# EAGLE design jerry_v1 (EAGLE 9.5.2)
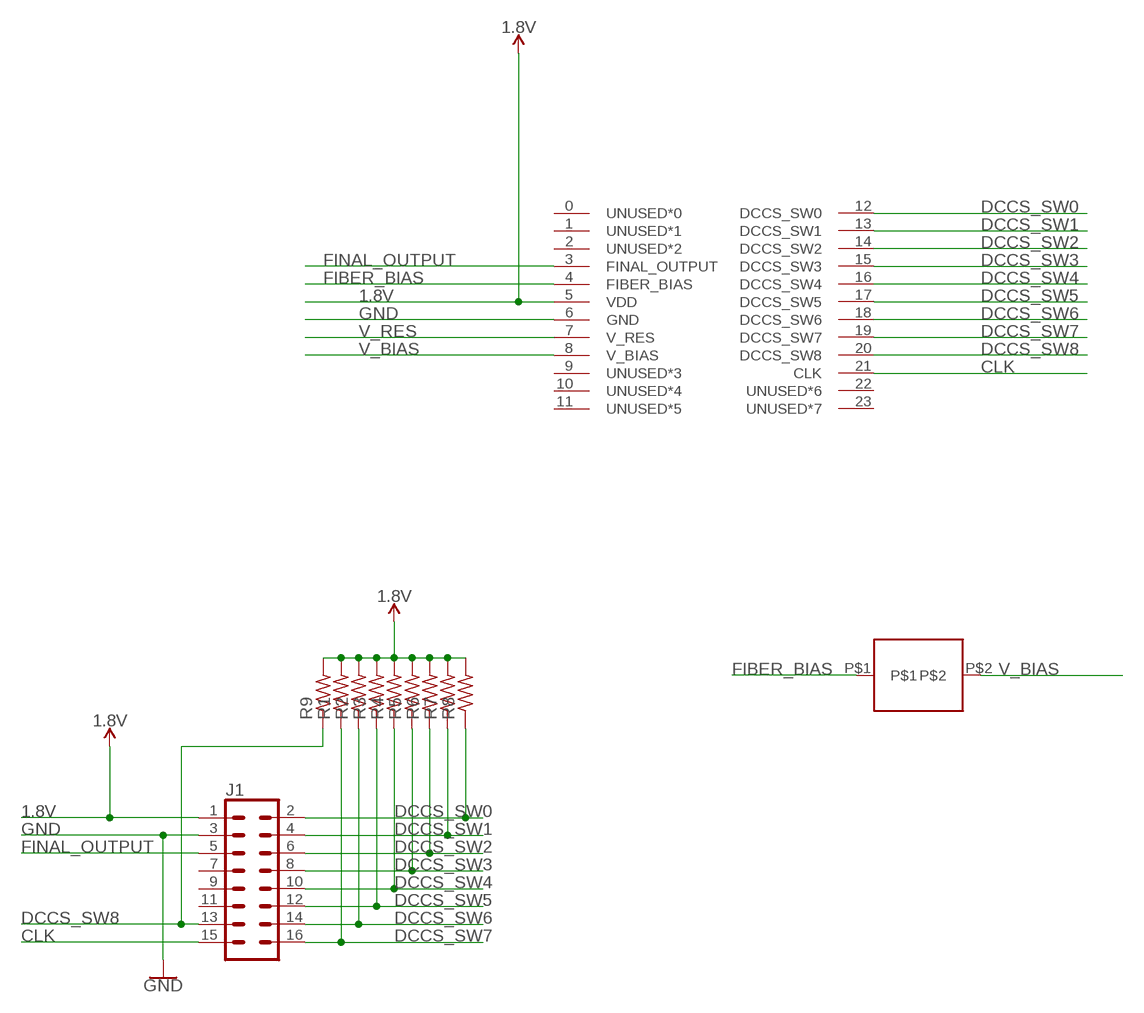
[diagram p0: schematic, sheet 1]

## Parts
J1  CONN_08X2  [2X8]
R1  R-US_R0402  [R0402]
R2  R-US_R0402  [R0402]
R3  R-US_R0402  [R0402]
R4  R-US_R0402  [R0402]
R5  R-US_R0402  [R0402]
R6  R-US_R0402  [R0402]
R7  R-US_R0402  [R0402]
R8  R-US_R0402  [R0402]
R9  R-US_R0402  [R0402]
U$1  JERRY_V1  [JERRY_V1]
U$2  FIBER  [FIBER]

## Nets
1.8V: J1.1 R1.2 R2.2 R3.2 R4.2 R5.2 R6.2 R7.2 R8.2 R9.2 U$1.5(VDD)
CLK: J1.15 U$1.21(CLK)
DCCS_SW0: J1.2 R8.1 U$1.12(DCCS_SW0)
DCCS_SW1: J1.4 R7.1 U$1.13(DCCS_SW1)
DCCS_SW2: J1.6 R6.1 U$1.14(DCCS_SW2)
DCCS_SW3: J1.8 R5.1 U$1.15(DCCS_SW3)
DCCS_SW4: J1.10 R4.1 U$1.16(DCCS_SW4)
DCCS_SW5: J1.12 R3.1 U$1.17(DCCS_SW5)
DCCS_SW6: J1.14 R2.1 U$1.18(DCCS_SW6)
DCCS_SW7: J1.16 R1.1 U$1.19(DCCS_SW7)
DCCS_SW8: J1.13 R9.1 U$1.20(DCCS_SW8)
FIBER_BIAS: U$1.4(FIBER_BIAS) U$2.P$1
FINAL_OUTPUT: J1.5 U$1.3(FINAL_OUTPUT)
GND: J1.3 U$1.6(GND)
V_BIAS: U$1.8(V_BIAS) U$2.P$2
V_RES: U$1.7(V_RES)
Unconnected: J1.7 J1.9 J1.11 U$1.0(UNUSED*0) U$1.1(UNUSED*1) U$1.2(UNUSED*2) U$1.9(UNUSED*3) U$1.10(UNUSED*4) U$1.11(UNUSED*5) U$1.22(UNUSED*6) U$1.23(UNUSED*7)

## Library data of the parts
J1 = SparkFun-Connectors:CONN_08X2: Multi connection point. Often used as Generic Header-pin footprint for 0.1 inch spaced/style header connections You can populate with any combo of single row headers, but if you'd like an exact match, check this: Header - 2x8 (Male, 0.1") <https://www.sparkfun.com/products/13156> (PRT-13156) On any of the 0.1 inch spaced packages, you can populate with these: Break Away Headers - Straight <https://www.sparkfun.com/products/116> (PRT-00116) Break Away Male Headers - Right Angle <https://www.sparkfun.com/products/553> (PRT-00553) Female Headers <https://www.sparkfun.com/products/115> (PRT-00115) Break Away Headers - Machine Pin <https://www.sparkfun.com/products/117> (PRT-00117) Break Away Female Headers - Swiss Machine Pin <https://www.sparkfun.com/products/743> (PRT-00743)
R1-R9 = rcl:R-US_: RESISTOR, American symbol; SPICEPREFIX: R
U$1 = jerry:JERRY_V1
U$2 = jerry:FIBER

## Board
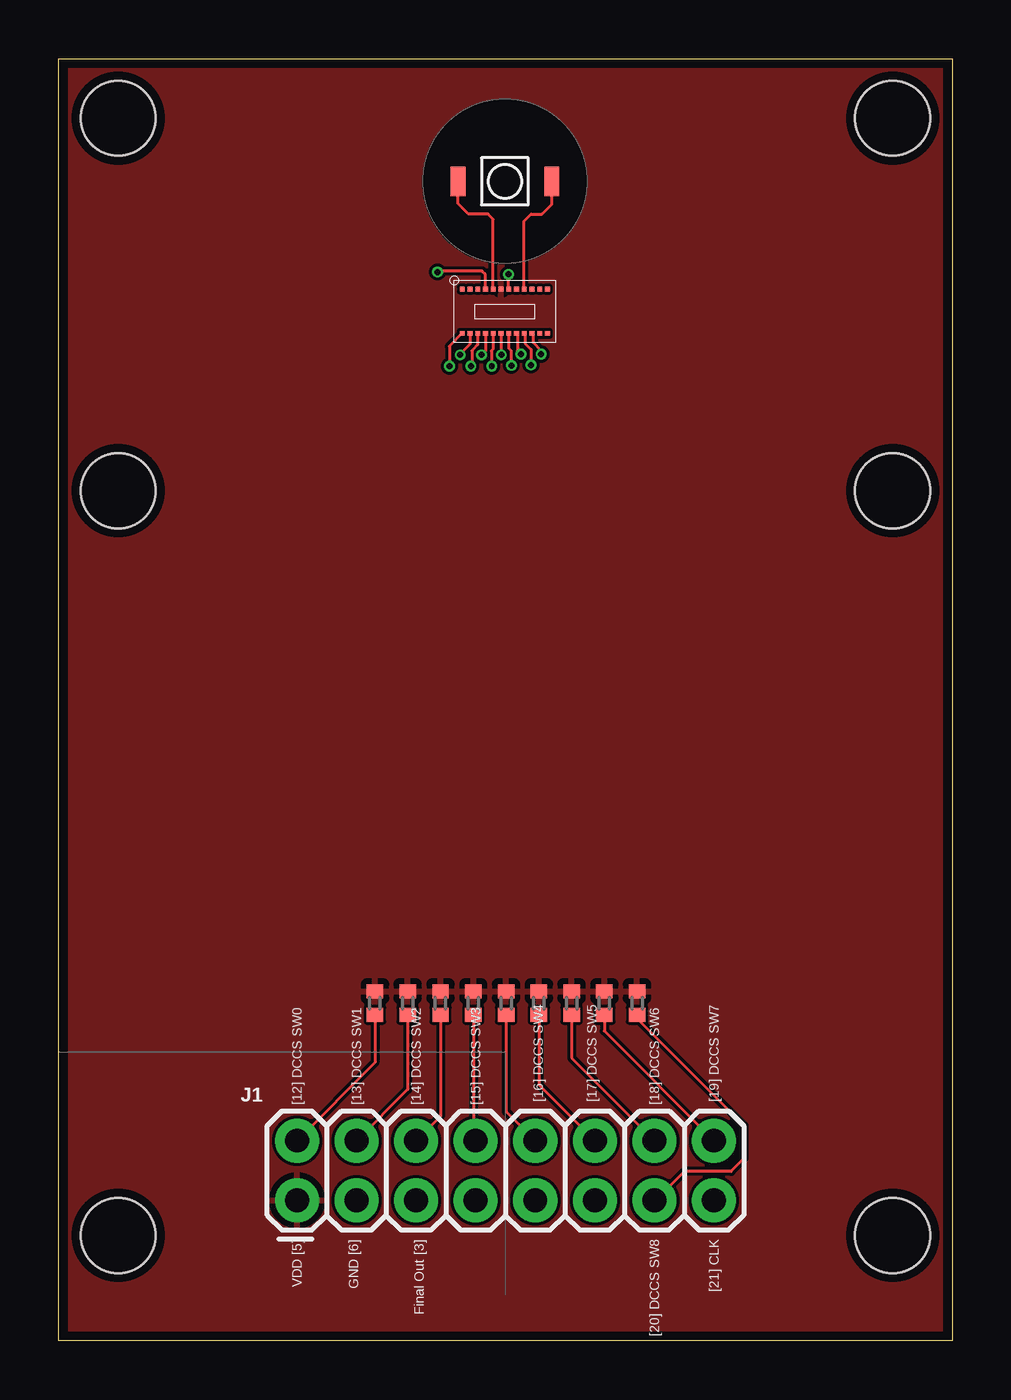
[diagram p1: board, top side]
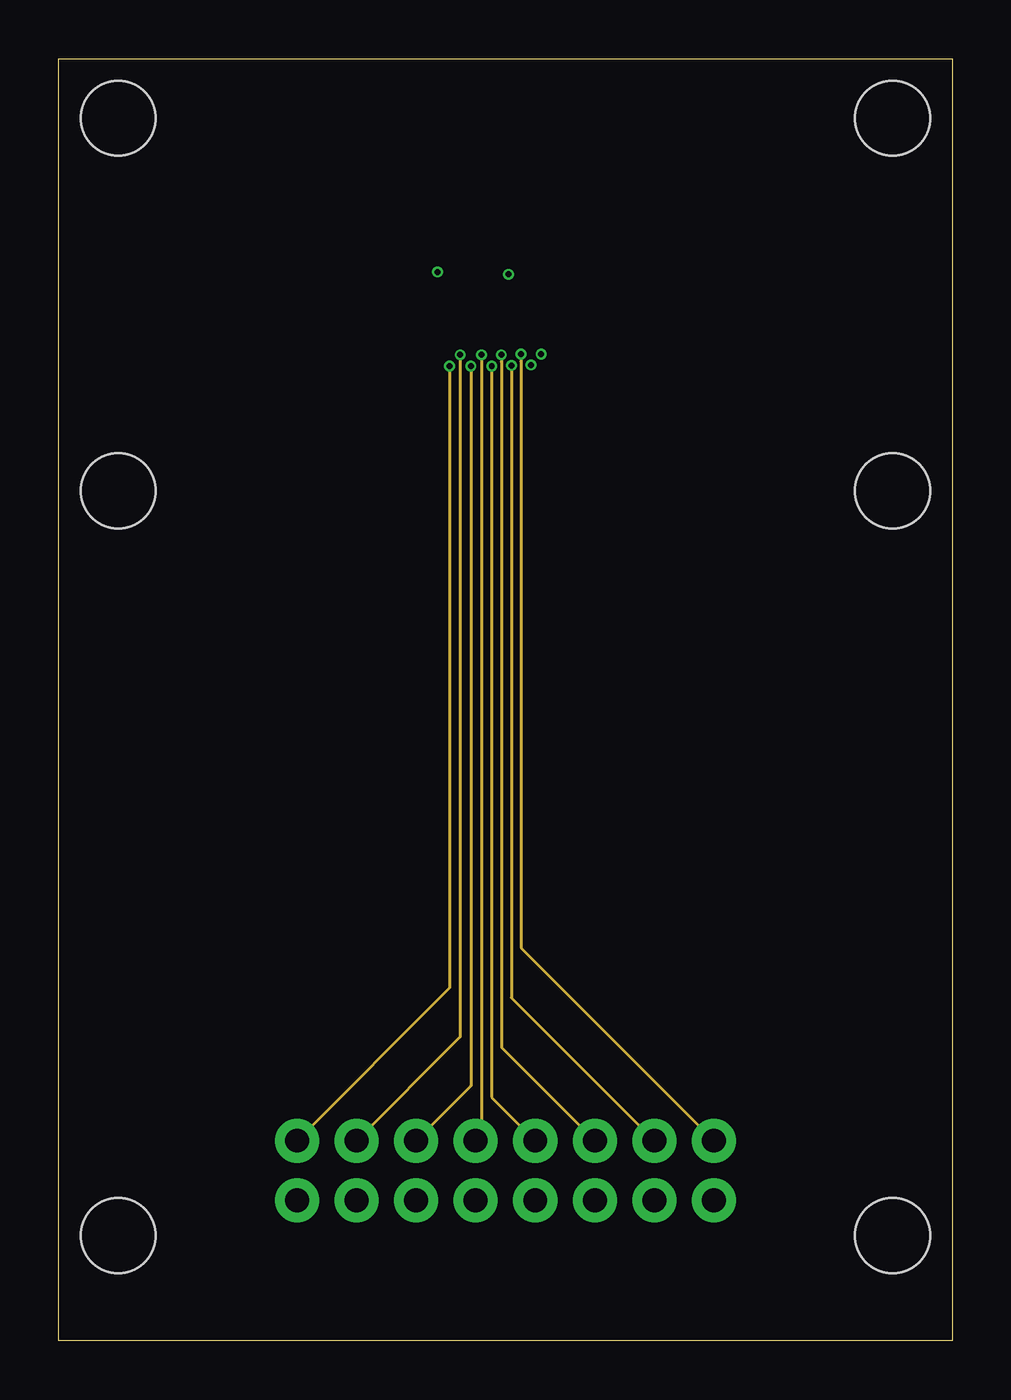
[diagram p2: board, inner layer Route2]
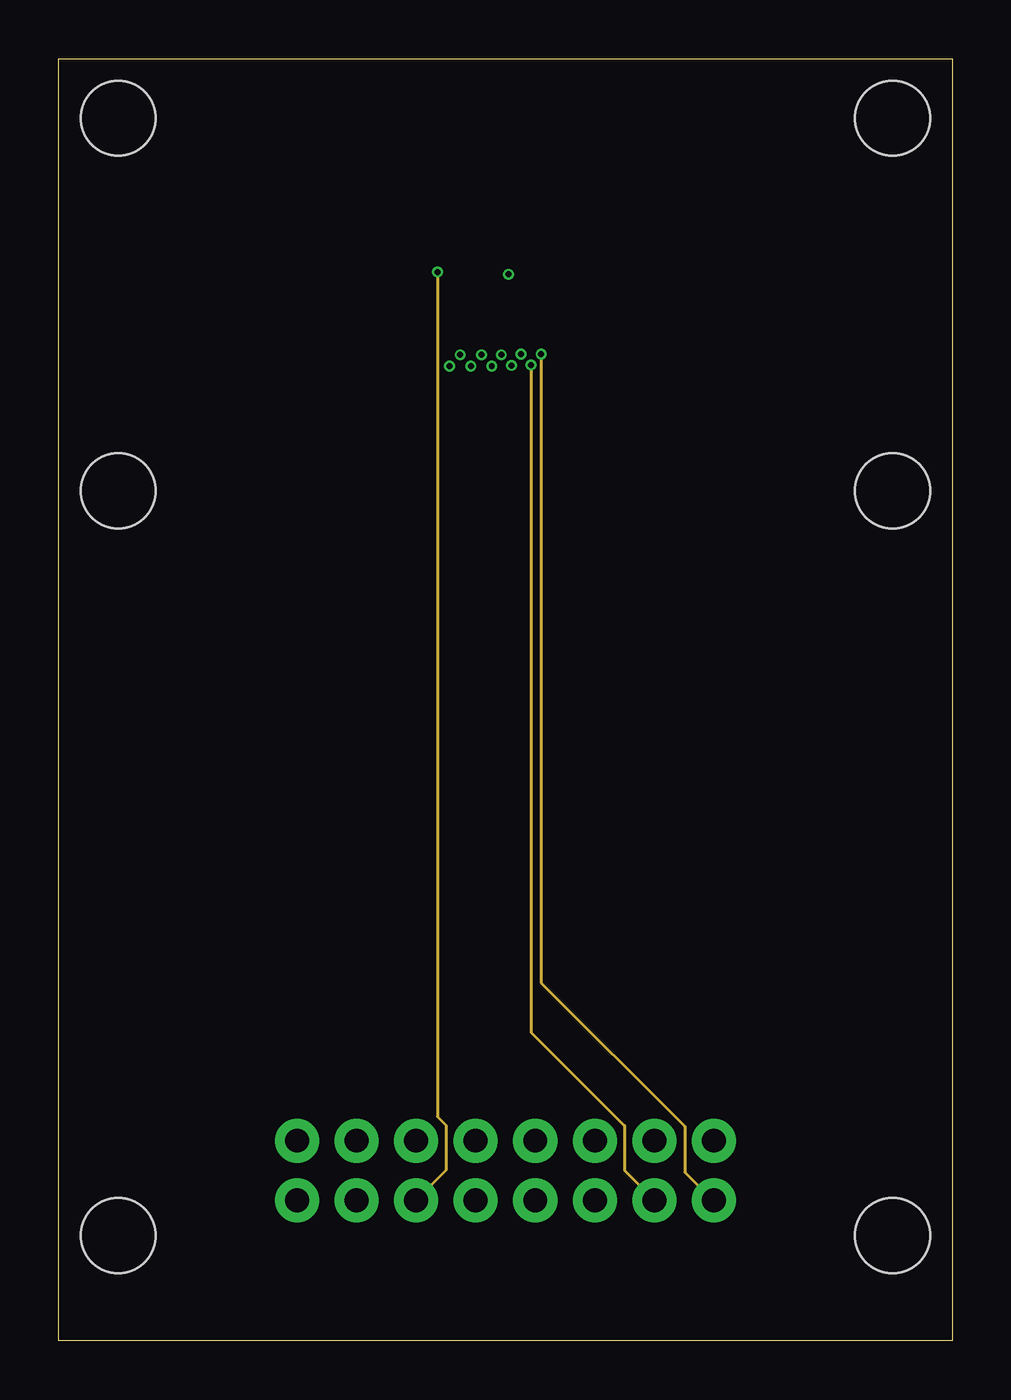
[diagram p3: board, inner layer Route15]
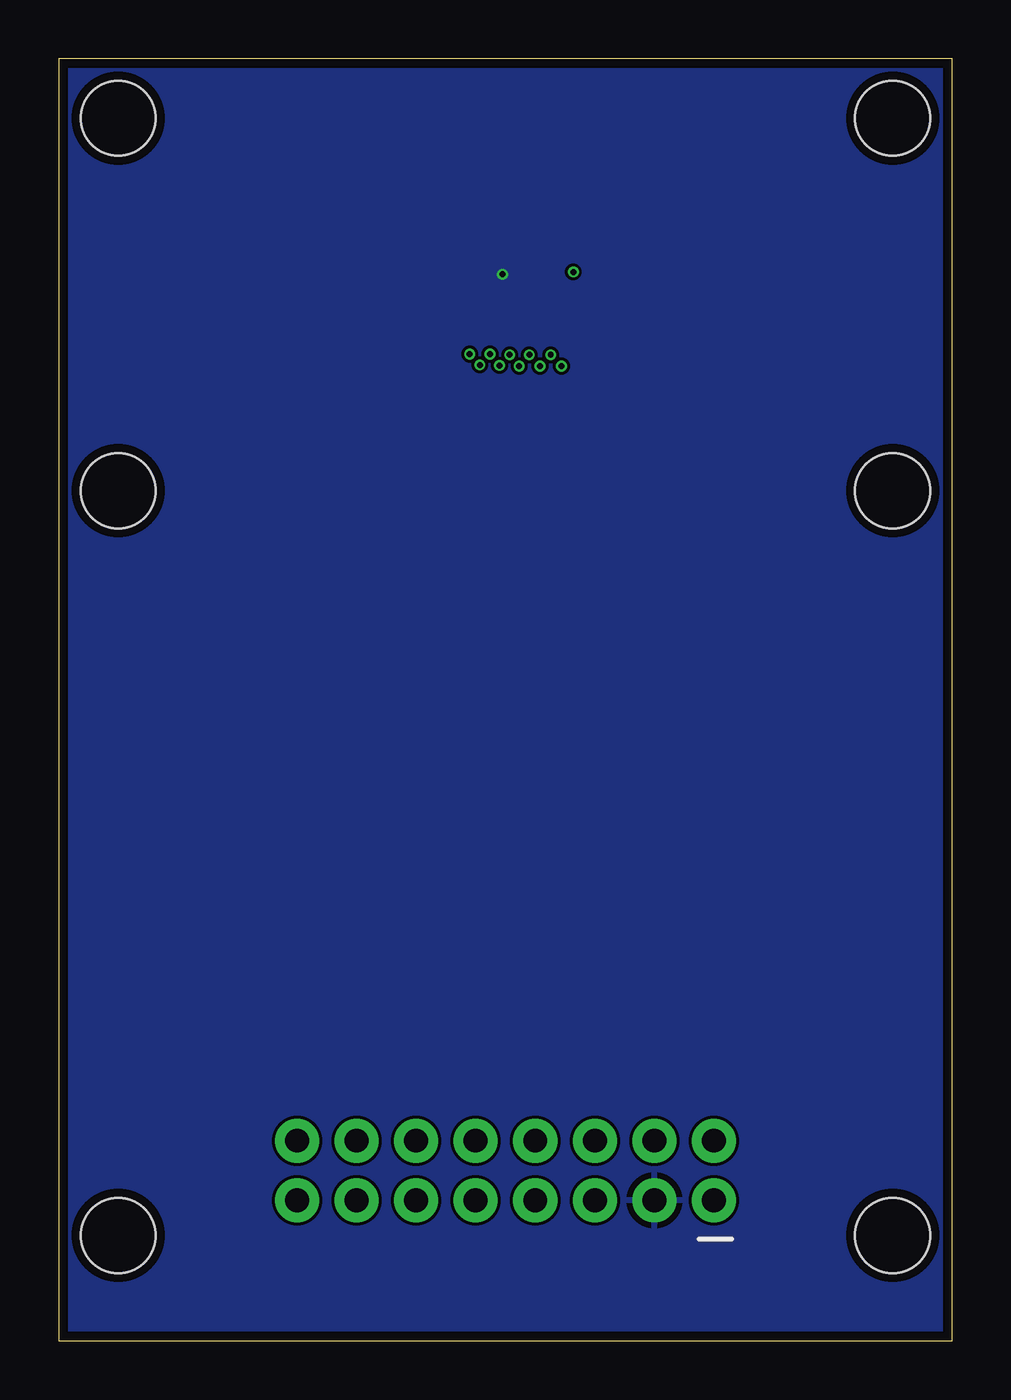
[diagram p4: board, bottom side, seen from below]

Size 38.1 x 54.66 mm. Coordinates in mm from the lower left corner, seen from the top.
Outline: 0,54.66 38.1,54.66 38.1,0 0,0 0,54.66
Copper layers (1*2*15*16): Top 0.035559375mm / dielectric 0.17018125mm / Route2 0.01778125mm / dielectric 47mil / Route15 0.01778125mm / dielectric 0.17018125mm / Bottom 0.035559375mm
Design rules "oshpark-4layer *": minimum track width 5mil, minimum drill 10mil, track to track 5mil, track to pad 5mil, pad to pad 5mil, via to via 5mil, smd to smd 5mil, copper to edge 15mil, drill to drill 6mil, minimum pad ring 4mil, minimum via ring 4mil, stop-mask expansion 2.5mil, vias tented up to drill 20mil, thermal gap 10mil
Holes 3.2 mm at 2.54,4.5 35.56,4.5 2.54,36.25 35.56,36.25 2.54,52.12 35.56,52.12
tRestrict: area 18,48.4 to 20.1,50.5; area 15.5,45.9 to 22.5,52.9

### Footprints (pad centres in the part's own frame; a part is rotated, then mirrored left to right if it is on the bottom)
2X8 = drill 1.016 pad 1.88: 1 0,0; 2 0,2.54; 3 2.54,0; 4 2.54,2.54; 5 5.08,0; 6 5.08,2.54; 7 7.62,0; 8 7.62,2.54; 9 10.16,0; 10 10.16,2.54; 11 12.7,0; 12 12.7,2.54; 13 15.24,0; 14 15.24,2.54; 15 17.78,0; 16 17.78,2.54
R0402 = smd 0.6 x 0.7: 1 -0.5,0; 2 0.5,0
JERRY_V1 = smd 0.203 x 0.203: 0 -0.546,1.27; 1 -0.216,1.27; 2 0.114,1.27; 3 0.445,1.27; 4 0.775,1.27; 5 1.105,1.27; 6 1.435,1.27; 7 1.765,1.27; 8 2.095,1.27; 9 2.426,1.27; 10 2.756,1.27; 11 3.086,1.27; 12 -0.546,-0.61; 13 -0.216,-0.61; 14 0.114,-0.61; 15 0.445,-0.61; 16 0.775,-0.61; 17 1.105,-0.61; 18 1.435,-0.61; 19 1.765,-0.61; 20 2.095,-0.61; 21 2.426,-0.61; 22 2.756,-0.61; 23 3.086,-0.61
FIBER = smd 0.635 x 1.27: P$1 -2,0; P$2 2,0

### Placement (x,y rotation side)
J1  10.16,5.99 0 top
R1  23.27,14.4 90 top
R2  21.87,14.4 90 top
R3  20.47,14.4 90 top
R4  19.08,14.4 90 top
R5  17.68,14.4 90 top
R6  16.28,14.4 90 top
R7  14.88,14.4 90 top
R8  13.49,14.4 90 top
R9  24.66,14.4 90 top
U$1  17.75,43.56 0 top
U$2  19.02,49.43 0 top

### Tracks (layer width: path | path; a pad name or v marks a point on that pad's centre or on a via)
1.8V
  pour Top: -5.21,60.38 46.48,60.38 51.44,55.42 51.44,3.1 42.93,-5.41 -14.73,-5.41 -15.62,-4.52 -15.62,49.96
CLK  (via drill 0.25)
  Top 0.127: U$1.21 20.22,42.91 20.22,42.57 20.57,42.21 v20.57,42.06
  Route15 0.127: v20.57,42.06 20.57,15.27 26.7,9.14 26.7,7.19 27.89,5.99 J1.15
DCCS_SW0  (via drill 0.25)
  Top 0.127: U$1.12 16.66,42.41 v16.66,41.55 | R8.1 13.49,11.86 J1.2
  Route2 0.127: v16.66,41.55 16.66,15.04 J1.2
DCCS_SW1  (via drill 0.25)
  Top 0.127: U$1.13 17.54,42.49 17.12,42.07 v17.12,42.04 | R7.1 14.88,10.72 J1.4
  Route2 0.127: v17.12,42.04 17.12,12.95 J1.4
DCCS_SW2  (via drill 0.25)
  Top 0.127: U$1.14 17.87,42.46 17.62,42.21 17.62,41.59 v17.58,41.55 | R6.1 16.28,9.58 J1.6
  Route2 0.127: v17.58,41.55 17.58,10.87 J1.6
DCCS_SW3  (via drill 0.25)
  Top 0.127: U$1.15 18.2,42.2 v18.03,42.04 | R5.1 17.68,8.64 J1.8
  Top 0.152: 17.94,8.69 J1.8
  Route2 0.127: v18.03,42.04 18.03,8.79 J1.8
DCCS_SW4  (via drill 0.25)
  Top 0.127: U$1.16 18.53,42.29 18.45,42.21 18.45,41.57 v18.47,41.55 | R4.1 19.07,9.78 J1.10
  Route2 0.127: v18.47,41.55 18.47,10.39 J1.10
DCCS_SW5  (via drill 0.25)
  Top 0.127: U$1.17 18.86,42.05 v18.87,42.04 | R3.1 20.47,10.92 J1.12
  Route2 0.127: v18.87,42.04 18.87,41.74 18.88,41.73 18.88,12.51 J1.12
DCCS_SW6  (via drill 0.25)
  Top 0.127: U$1.18 19.19,42.31 19.29,42.21 19.29,41.59 v19.3,41.58 | R2.1 21.87,12.06 J1.14
  Route2 0.127: v19.3,41.58 19.3,14.63 J1.14
DCCS_SW7  (via drill 0.25)
  Top 0.127: U$1.19 19.56,42.91 19.56,42.21 v19.71,42.06 | R1.1 23.27,13.21 J1.16
  Route2 0.127: v19.71,42.06 19.71,41.77 19.72,41.75 19.72,16.75 J1.16
DCCS_SW8  (via drill 0.25)
  Top 0.127: U$1.20 19.89,42.91 19.89,42.52 20.14,42.26 v20.14,41.6 | R9.1 24.66,13.74 29.22,9.18 29.22,7.79 28.66,7.23 26.68,7.23 25.45,5.99 J1.13
  Route15 0.127: v20.14,41.6 20.14,13.16 24.13,9.17 24.13,7.26 J1.13
FIBER_BIAS
  Top 0.127: U$1.4 18.53,47.82 18.31,48.03 17.48,48.03 17.02,48.48 U$2.P$1
FINAL_OUTPUT  (via drill 0.25)
  Top 0.127: v16.15,45.57 16.19,45.61 18.06,45.61 18.2,45.47 U$1.3
  Route15 0.127: 16.52,7.28 16.51,7.26 | 16.51,7.26 J1.5 | 16.51,7.26 16.51,9.19 16.15,9.55 v16.15,45.57
GND  (via drill 0.25)
  Top 0.127: U$1.6 19.19,45.45 v19.18,45.47
  pour Bottom: -0.25,57.58 44.45,57.58 44.45,-0.97 43.31,-2.11 -6.22,-2.11 -9.14,0.81 -9.14,48.69
V_BIAS
  Top 0.127: U$1.8 19.85,47.74 20.14,48.03 20.6,48.03 21.02,48.46 U$2.P$2

### Text on the board
tPlace: [12] DCCS SW0 | [13] DCCS SW1 | [14] DCCS SW2 | [15] DCCS SW3 | [16] DCCS SW4 | [17] DCCS SW5 | [18] DCCS SW6 | [19] DCCS SW7 | VDD [5] | GND [6] | Final Out [3] | [20] DCCS SW8 | [21] CLK